# Altium schematic sheet LPF_Interface.SchDoc
size A4; SheetNumber: 11; SheetTotal: 13
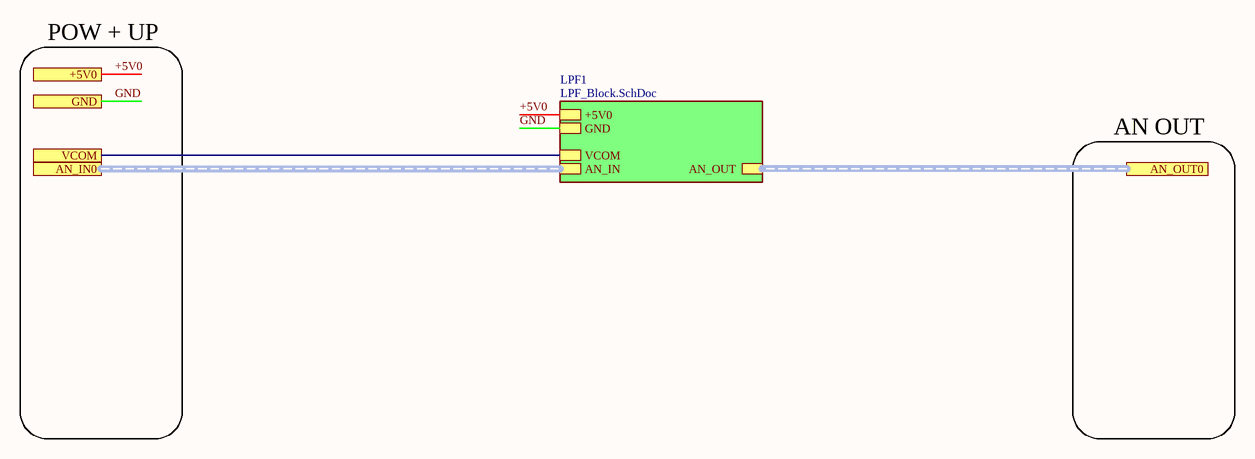
[diagram p0: LPF_Interface.SchDoc]

## Sub-sheets
LPF1 = LPF_Block.SchDoc: GND, +5V0, VCOM, AN_IN (harness AN), AN_OUT (harness AN)

## Ports
+5V0 (see AudioDSP-v3.0.0c_top[7B], DAC_Block[1B], LPF_Block[1B], POW_Block[4B]), AN_IN0 (harness AN, see AudioDSP-v3.0.0c_top[7B]), AN_OUT0 (harness AN, see AudioDSP-v3.0.0c_top[7B]), GND (see AudioDSP-v3.0.0c_top[7B], ADC_Block[1B], ADC_Interface[1B], CTRL_Connectors[1A], DAC_Block[1B], DSP_Block[1A], IN_Connectors[3A], LPF_Block[1B], MCU_Block[1B], OUT_Connectors[3B], PLL_Block[1A], POW_Block[1B]), VCOM (see AudioDSP-v3.0.0c_top[7B], DAC_Block[4C], LPF_Block[1C])

## Nets
+5V0: port +5V0, sheet LPF1/+5V0
GND: port GND, sheet LPF1/GND
VCOM: port VCOM, sheet LPF1/VCOM

## Buses and harness runs
harness port AN_IN0 = sheet LPF1/AN_IN
harness port AN_OUT0 = sheet LPF1/AN_OUT

## Notes on the sheet
- POW + UP
- AN OUT